# EasyEDA Pro project ProPrj_智能警报器（终版）_2025-03-04_22-10-02_2025-04-22.epro, board 检测装置PCB
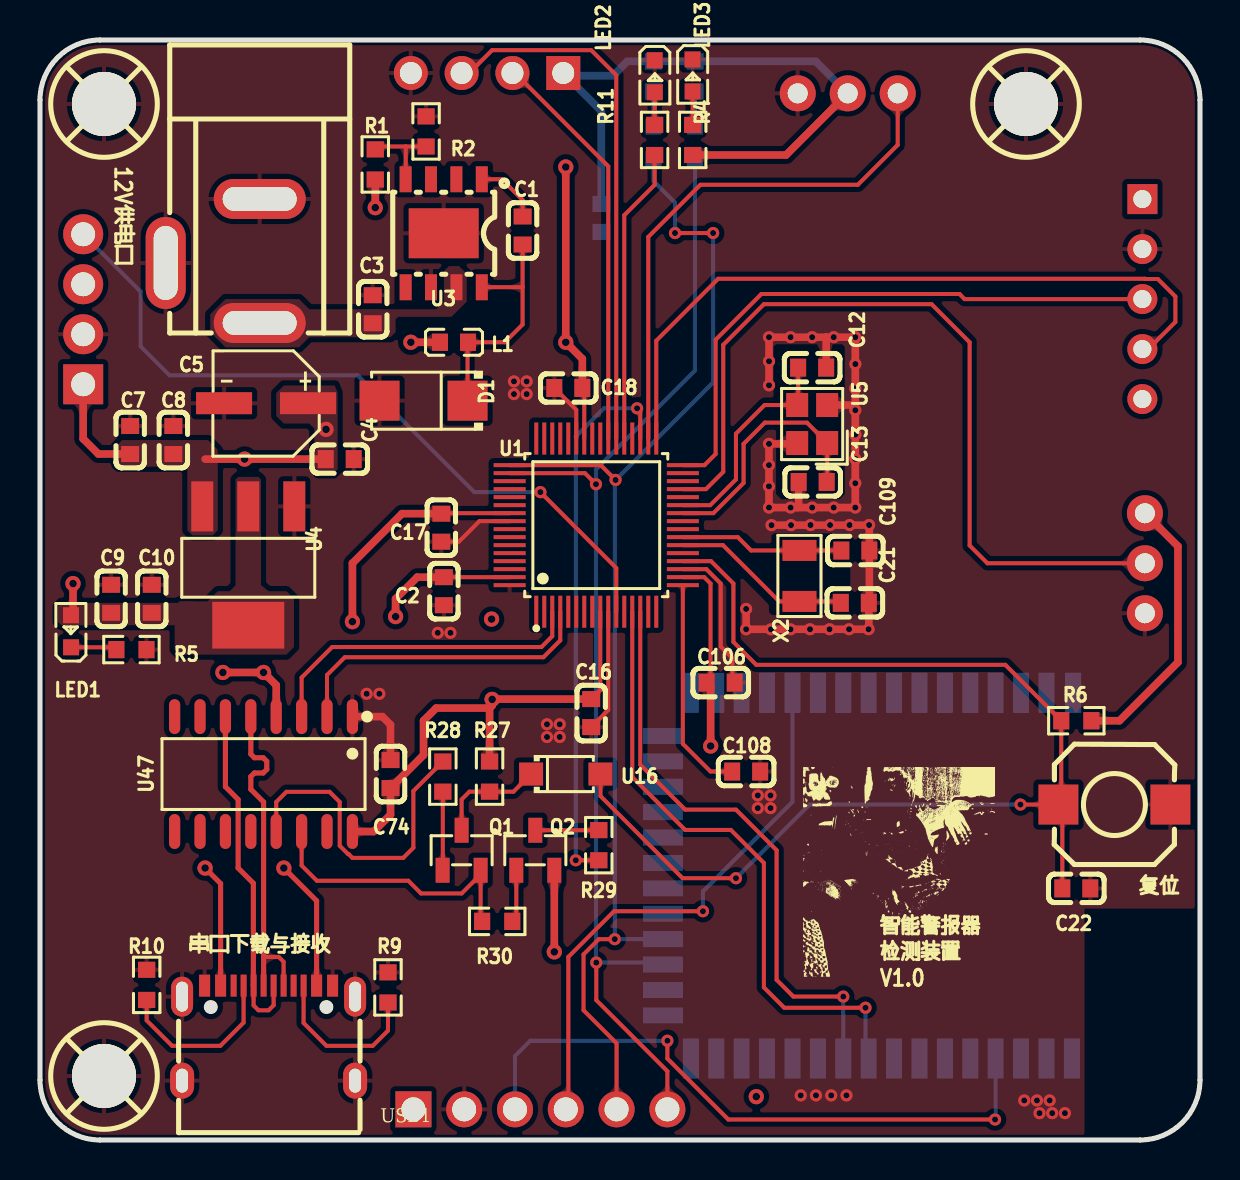
[diagram p14: board, top side]
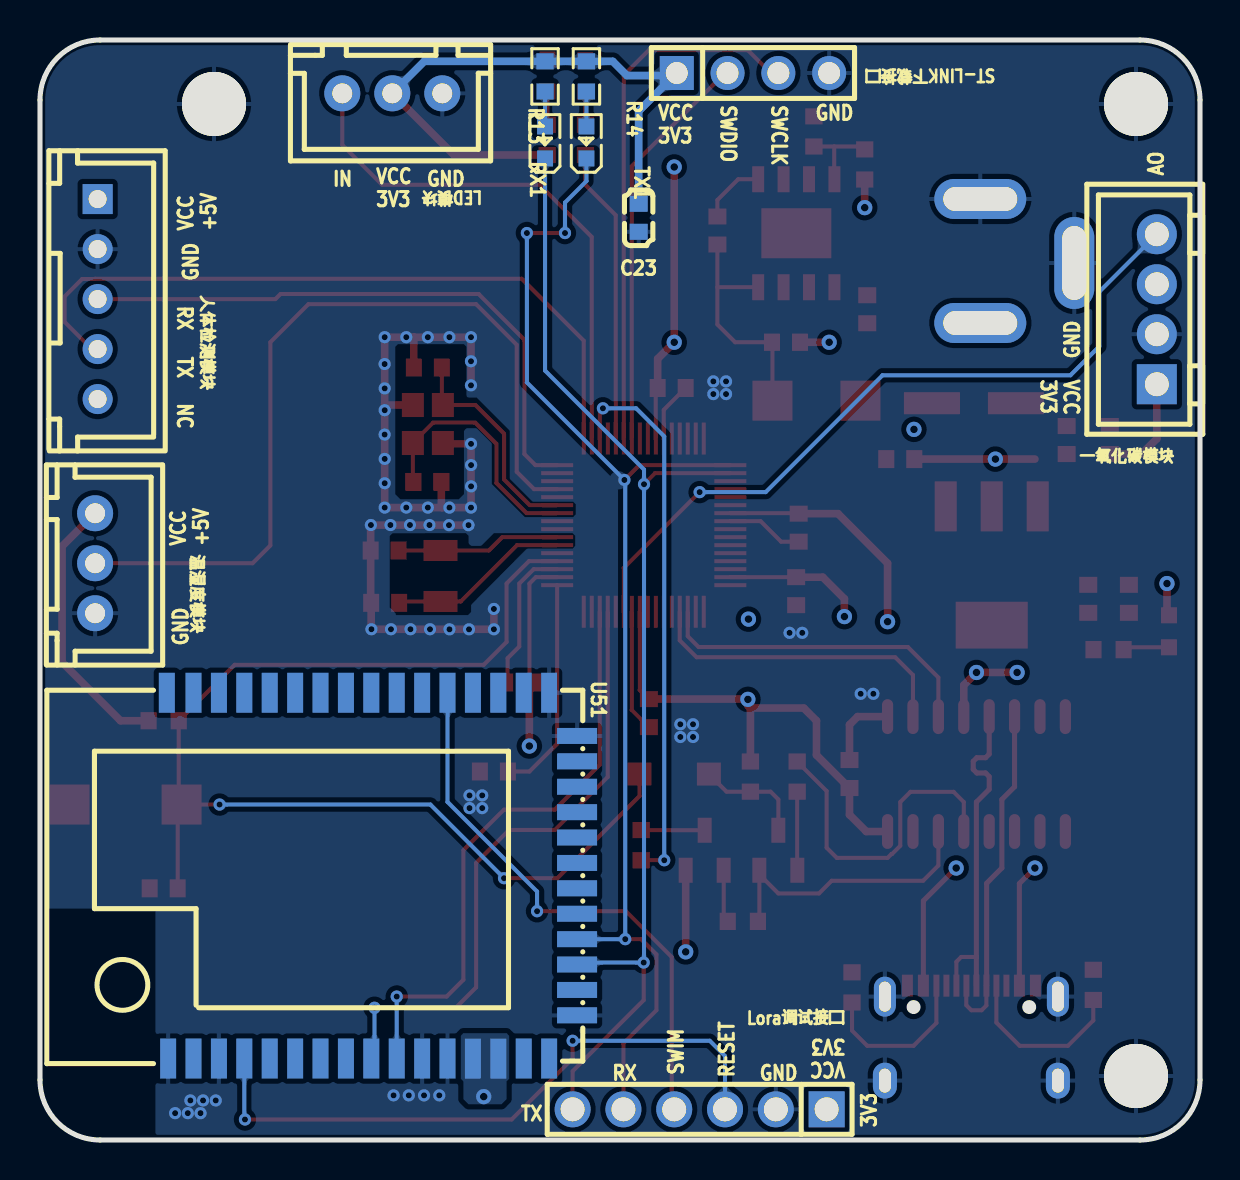
[diagram p15: board, bottom side, seen from below]

Outline 58 x 55 mm; copper layers: Top Layer, 电源层, 接地层, Bottom Layer. Coordinates in mm from the lower left corner of the outline.
Outline path: 0,52 0,3 arc(0.88,0.88) 3,0 55,0 arc(57.12,0.88) 58,3 58,52 arc(57.12,54.12) 55,55 3,55 arc(0.88,54.12) 0,52
Stack: Top Layer 0.035mm 外层铜厚1oz / Dielectric1 0.2104mm 7628 RC49% 8.6mil / 电源层 0.0152mm 内层铜厚 / Dielectric2 1.065mm 1.1mm H/HOZ Copper / 接地层 0.0152mm 内层铜厚 / Dielectric3 0.2104mm 7628 RC49% 8.6mil / Bottom Layer 0.035mm 外层铜厚1oz

## Design rules (mm)
net USB_D+: DP1
net USB_D-: DP1
template: 自定义配置
spacing copperThickness1oz (default): track to track 0.102, other pairs 0.152 to 0.3
spacing copperThickness2oz: track to track 0.203, other pairs 0.152 to 0.3
track width copperThickness1oz (default): min 0.127, default 0.203, max 2.54
track width copperThickness2oz: min 0.203, default 0.254, max 2.54
track width GND: min 0.254, default 0.381, max 2.54
track width VCC: min 0.254, default 0.381, max 2.54
differential pair differentialPair (default): width min 0.127, default 0.254, max 2.54; gap min 0.152, default 0.152
via viaSize (default): diameter min 0.5, default 0.61, max 10; hole min 0.3, default 0.305, max 6.299
via viaSize1: diameter min 0.61, default 0.762, max 10; hole min 0.305, default 0.381, max 6.3

## Placement (name value [footprint] x y rotation side)
C1  10NF  [C0603]  24.13 45.47 270 top
C2  100nF  [C0603]  20.19 27.44 90 top
C3  10uF  [C0603]  16.64 41.54 270 top
C4  10nF  [C0603]  14.99 34.05 180 top
C5  330uF  [CAP-SMD_BD5.0-L5.3-W5.3-FD]  11.3 36.84 180 top
C7  10uF  [C0603]  4.51 35 270 top
C8  100nF  [C0603]  6.67 35 270 top
C9  10uF  [C0603]  3.56 27.06 90 top
C10  100nF  [C0603]  5.59 27.06 90 top
C12  12pF  [C0603]  38.61 38.62 0 top
C13  12pF  [C0603]  38.63 32.9 180 top
C16  100nF  [C0603]  27.56 21.34 90 top
C17  100nF  [C0603]  20.07 30.62 90 top
C18  100nF  [C0603]  26.42 37.6 0 top
C21  10pF  [C0603]  40.74 26.86 180 top
C22  10nF  [C0603]  51.82 12.58 180 top
C23  100nF  [C0603]  28.07 46.11 90 bottom
C74  10uF  [C0603]  17.53 18.3 270 top
C106  100nF  [C0603]  34.04 22.87 180 top
C108  2.2uF  [C0603]  35.31 18.42 180 top
C109  10pF  [C0603]  40.77 29.47 180 top
CN1  WAFER-XH254Z-4A  [CONN-TH_XH-4A]  2.16 41.54 90 bottom
D1  B340A  [SMA_L4.3-W2.6-LS5.1-RD]  19.18 36.97 180 top
DC2  -  [DC-005_2.5]  10.67 44.08 90 top
H5  -  [HDR-TH_6P-P2.54-V-M-1]  25.02 1.53 0 bottom
H6  -  [HDR-TH_4P-P2.54-V-M]  22.35 53.35 180 bottom
L1  15uH  [L0603]  20.7 39.89 0 top
LED1  -  [LED_0603]  1.54 25.49 90 top
LED2  -  [LED_0603]  30.74 53.14 270 top
LED3  -  [LED_0603]  32.64 53.18 270 top
Q1  S8050  [SOT-23-3_L2.9-W1.3-P1.90-LS2.4-BR]  21.08 14.49 270 top
Q2  S8550  [SOT-23-3_L2.9-W1.3-P1.90-LS2.4-BR]  24.76 14.49 270 top
R1  10KΩ  [R0603]  16.76 48.78 90 top
R2  3.24KΩ  [R0603]  19.3 50.43 90 top
R4  1KΩ  [R0603]  32.64 50 270 top
R5  2kΩ  [R0603]  4.57 24.52 0 top
R6  1KΩ  [R0603]  51.82 20.96 0 top
R9  5.1KΩ  [R0603]  17.4 7.63 90 top
R10  5.1KΩ  [R0603]  5.33 7.76 90 top
R11  1KΩ  [R0603]  30.73 50 270 top
R13  1kΩ  [R0603]  32.75 53.18 90 bottom
R14  1kΩ  [R0603]  30.68 53.18 90 bottom
R27  10K  [R0603]  22.48 18.17 90 top
R28  1K  [R0603]  20.14 18.17 270 top
R29  1K  [R0603]  27.94 14.74 90 top
R30  1K  [R0603]  22.86 10.93 0 top
RX1  KT-0603R  [LED0603-RD]  32.75 49.88 90 bottom
SCREW1  -  [M3螺丝]  3.2 51.8 0 top
SCREW2  -  [M3螺丝]  49.3 51.8 0 top
SCREW3  -  [M3螺丝]  3.2 3.2 0 top
TX1  KT-0603R  [LED0603-RD]  30.68 49.88 90 bottom
U1  HT32F52352  [LQFP-64_L7.0-W7.0-P0.40-LS9.2-BL]  27.81 30.74 0 top
U3  TPS5430DDAR  [ESOP-8_L4.9-W3.9-P1.27-LS6.0-TL-EP]  20.19 45.34 270 top
U4  AMS1117-3.3  [SOT-223-3_L6.5-W3.4-P2.30-LS7.0-BR]  10.41 28.71 90 top
U5  8MHz  [CRYSTAL-SMD_4P-L2.5-W2.0-BL]  38.61 35.8 90 top
U9  轻触开关/软触开关(无声)/贴片6*6*5  [SW-SMD_L6.0-W5.9-LS6.6]  53.72 16.77 180 top
U16  1N4007W  [SOD-123FL_L2.7-W1.8-LS3.7-RD]  26.29 18.3 0 top
U47  CH340C  [SOP-16_L10.0-W3.9-P1.27-LS6.0-BL]  11.18 18.3 180 top
U48  WAFER-XH254Z-5A  [CONN-TH_5P-P2.50_WAFER-XH254Z-5A]  55.12 42.05 270 bottom
U49  WAFER-XH254Z-3A  [CONN-TH_XH-3A]  55.25 28.84 270 bottom
U50  WAFER-XH254Z-3A  [CONN-TH_XH-3A]  40.39 52.33 0 bottom
U51  WH-L101-L-C  [COMM-SMD_WH-L101-L-C]  41.4 13.22 90 bottom
USB1  TYPE-C 16PIN 2MD(073)  [USB-C-SMD_TYPE-C-6PIN-2MD-073]  11.43 5.34 0 top
X2  32.768kHz  [OSC-SMD_L3.2-W1.5]  37.97 28.2 90 top

## Footprints (pads in the part's own frame, mm; a bottom-side part is the same pattern mirrored in y, then rotated)
C0603
  rect 0.8x0.9 smd: 1(-0.7,0) 2(0.7,0)
CAP-SMD_BD5.0-L5.3-W5.3-FD
  rect 2.8x1.1 smd: 1(-2.1,0) 2(2.1,0)
COMM-SMD_WH-L101-L-C
  rect 2x0.8 smd: 1(-9.144,10.192) 2(-9.144,8.922) 3(-9.144,7.652) 4(-9.144,6.382) 5(-9.144,5.112) 6(-9.144,3.842) 7(-9.144,2.572) 8(-9.144,1.302) 9(-9.144,0.032) 10(-9.144,-1.238) 11(-9.144,-2.509) 12(-9.144,-3.779) 13(-9.144,-5.048) 14(-9.144,-6.319) 15(-9.144,-7.588) 16(-9.144,-8.858) 29(9.144,-8.858) 30(9.144,-7.588) 31(9.144,-6.319) 32(9.144,-5.048) 33(9.144,-3.779) 34(9.144,-2.509) 35(9.144,-1.238) 36(9.144,0.032) 37(9.144,1.302) 38(9.144,2.572) 39(9.144,3.842) 40(9.144,5.112) 41(9.144,6.382) 42(9.144,7.652) 43(9.144,8.922) 44(9.144,10.255)
  rect 0.8x2 smd: 17(-6.985,-10.255) 18(-5.715,-10.255) 19(-4.445,-10.255) 20(-3.175,-10.255) 21(-1.905,-10.255) 22(-0.635,-10.255) 23(0.635,-10.255) 24(1.905,-10.255) 25(3.175,-10.255) 26(4.445,-10.255) 27(5.715,-10.255) 28(6.985,-10.255)
CONN-TH_5P-P2.50_WAFER-XH254Z-5A
  rect 1.5x1.5 hole 0.9: 1(-5,0)
  round 1.5 hole 0.9: 2(-2.5,0) 3(0,0) 4(2.5,0) 5(5,0)
CONN-TH_XH-3A
  round 1.8 hole 1: 1(-2.5,0) 2(0,0) 3(2.5,0)
CONN-TH_XH-4A
  rect 2x2 hole 1.2: 1(-3.75,0)
  round 2 hole 1.2: 2(-1.25,0) 3(1.25,0) 4(3.75,0)
CRYSTAL-SMD_4P-L2.5-W2.0-BL
  rect 1.2x1.1 smd: 1(-0.95,-0.75) 2(0.95,-0.75) 3(0.95,0.75) 4(-0.95,0.75)
DC-005_2.5
  oval 2x4.6 hole 1.2x3.7: 1(-3.227,-0.318) 2(2.973,-0.318)
  oval 4.6x2 hole 3.7x1.2: 3(-0.227,4.382)
ESOP-8_L4.9-W3.9-P1.27-LS6.0-TL-EP
  rect 1.3x0.6 smd: 1(-2.7,1.905) 2(-2.7,0.635) 3(-2.7,-0.635) 4(-2.7,-1.905) 5(2.7,-1.905) 6(2.7,-0.635) 7(2.7,0.635) 8(2.7,1.905)
  rect 2.5x3.5 smd: 9(0,0)
HDR-TH_4P-P2.54-V-M
  rect 1.7x1.7 hole 1.1: 1(-3.81,0)
  round 1.7 hole 1.1: 2(-1.27,0) 3(1.27,0) 4(3.81,0)
HDR-TH_6P-P2.54-V-M-1
  rect 1.8x1.8 hole 1.2: 1(-6.35,0)
  round 1.8 hole 1.2: 2(-3.81,0) 3(-1.27,0) 4(1.27,0) 5(3.81,0) 6(6.35,0)
L0603
  rect 0.8x0.864 smd: 1(-0.7,0) 2(0.7,0)
LED0603-RD
  rect 0.8x0.8 smd: 1(-0.799,0) 2(0.799,0)
LED_0603
  rect 0.8x0.8 smd: 1(-0.851,-0.01) 2(0.75,-0.005)
LQFP-64_L7.0-W7.0-P0.40-LS9.2-BL
  rect 0.2x1.6 smd: 1(-3,-4.33) 2(-2.6,-4.33) 3(-2.2,-4.33) 4(-1.8,-4.33) 5(-1.4,-4.33) 6(-1,-4.33) 7(-0.6,-4.33) 8(-0.2,-4.33) 9(0.2,-4.33) 10(0.6,-4.33) 11(1,-4.33) 12(1.4,-4.33) 13(1.8,-4.33) 14(2.2,-4.33) 15(2.6,-4.33) 16(3,-4.33) 33(3,4.33) 34(2.6,4.33) 35(2.2,4.33) 36(1.8,4.33) 37(1.4,4.33) 38(1,4.33) 39(0.6,4.33) 40(0.2,4.33) 41(-0.2,4.33) 42(-0.6,4.33) 43(-1,4.33) 44(-1.4,4.33) 45(-1.8,4.33) 46(-2.2,4.33) 47(-2.6,4.33) 48(-3,4.33)
  rect 1.6x0.2 smd: 17(4.33,-3) 18(4.33,-2.6) 19(4.33,-2.2) 20(4.33,-1.8) 21(4.33,-1.4) 22(4.33,-1) 23(4.33,-0.6) 24(4.33,-0.2) 25(4.33,0.2) 26(4.33,0.6) 27(4.33,1) 28(4.33,1.4) 29(4.33,1.8) 30(4.33,2.2) 31(4.33,2.6) 32(4.33,3) 49(-4.33,3) 50(-4.33,2.6) 51(-4.33,2.2) 52(-4.33,1.8) 53(-4.33,1.4) 54(-4.33,1) 55(-4.33,0.6) 56(-4.33,0.2) 57(-4.33,-0.2) 58(-4.33,-0.6) 59(-4.33,-1) 60(-4.33,-1.4) 61(-4.33,-1.8) 62(-4.33,-2.2) 63(-4.33,-2.6) 64(-4.33,-3)
M3螺丝
  round 3.2 hole 3.2: 1(0,0)
OSC-SMD_L3.2-W1.5
  rect 1.05x1.7 smd: 1(-1.275,0) 2(1.275,0)
R0603
  rect 0.806x0.864 smd: 1(-0.753,0) 2(0.753,0)
SMA_L4.3-W2.6-LS5.1-RD
  rect 2x2 smd: 1(-2.2,0) 2(2.2,0)
SOD-123FL_L2.7-W1.8-LS3.7-RD
  rect 1.2x1.15 smd: 1(-1.735,0) 2(1.735,0)
SOP-16_L10.0-W3.9-P1.27-LS6.0-BL
  oval 0.56x1.745 smd: 1(-4.445,-2.873) 2(-3.175,-2.873) 3(-1.905,-2.873) 4(-0.635,-2.873) 5(0.635,-2.873) 6(1.905,-2.873) 7(3.175,-2.873) 8(4.445,-2.873) 9(4.445,2.873) 10(3.175,2.873) 11(1.905,2.873) 12(0.635,2.873) 13(-0.635,2.873) 14(-1.905,2.873) 15(-3.175,2.873) 16(-4.445,2.873)
SOT-23-3_L2.9-W1.3-P1.90-LS2.4-BR
  rect 1.25x0.7 smd: 1(1,-0.95) 2(1,0.95) 3(-1,0)
SOT-223-3_L6.5-W3.4-P2.30-LS7.0-BR
  rect 2.5x1.1 smd: 1(2.97,-2.3) 2(2.97,0) 3(2.97,2.3)
  rect 2.34x3.6 smd: 4(-2.97,0)
SW-SMD_L6.0-W5.9-LS6.6
  rect 2x2 smd: 1(-2.8,0) 2(2.8,0)
USB-C-SMD_TYPE-C-6PIN-2MD-073
  rect 0.55x1.1 smd: 1(-3.2,2.375) 2(-2.4,2.375) 11(2.4,2.375) 12(3.2,2.375)
  rect 0.3x1.1 smd: 3(-1.75,2.375) 4(-1.25,2.375) 5(-0.75,2.375) 6(-0.25,2.375) 7(0.25,2.375) 8(0.75,2.375) 9(1.25,2.375) 10(1.75,2.375)
  oval 1.1x2 hole 0.6x1.5: 13(-4.325,1.825) 14(4.325,1.825)
  oval 1.2x1.8 hole 0.6x1.2: 13(-4.325,-2.375) 14(4.325,-2.375)

## Nets
As in the schematic.

Pads without a net: U1 1 2 5 6 7 8 12 15 16 21 24 25 28 30 31 36 40 41 44 45 46 47 48 51 52 53 54 57 58 59 60 61 62; U3 2 3 5; U47 7 8 9 10 11 12 15; U51 2 5 6 7 8 15 16 18 21 22 23 24 25 26 27 30 31 32 34 35 36 37 38 39 40 41 42 43 44; USB1 3 9

## Via types
v1: diameter 0.61, hole 0.305, Top Layer to Bottom Layer, 77 vias
v2: diameter 0.762, hole 0.381, Top Layer to Bottom Layer, 18 vias

## Routing (per net, layer and track width the routed paths; a pad name or vN(x,y) marks a point on that pad's centre or on a via; arc(x,y) is an arc through that point)
GND: length 70
  Top Layer w0.203: C106.1 34.62,22.98 34.62,24.09 34.04,24.67 34.04,27.82 33.31,28.54 32.14,28.54 ; C16.1 28.41,21.5 U1.10 ; C17.1 20.94,29.92 21.97,30.94 23.48,30.94 ; C18.1 26.81,36.5 U1.43
  Top Layer w0.381: 39.31,40.14 39.31,40.14 C12.2 ; 39.31,40.14 v1(38.61,40.14) v1(37.53,40.14) v1(36.45,40.14) v1(36.45,38.94) v1(36.45,37.73) ; 39.31,40.14 v1(39.69,40.14) v1(40.76,40.14) v1(40.76,37.58) 40.76,36.82 ; 37.9,31.62 v1(37.53,31.62) v1(36.45,31.62) 36.45,31.62 v1(36.45,32.68) 36.45,33.62 36.32,33.75 ; 37.9,31.62 v1(38.61,31.62) v1(39.69,31.62) v1(40.76,31.62) v1(40.76,32.84) v1(40.76,34.06) v1(40.76,36.49) 40.76,36.82 ; 37.9,31.62 37.93,31.66 C13.2 ; U47.1 17.12,21.17 17.53,20.76 C74.1 ; v1(35.31,26.55) v1(35.31,25.54) 36.55,25.54 v1(36.55,25.53) 36.56,25.54 v1(38.5,25.54) v1(39.48,25.54) v1(40.45,25.54) v1(41.43,25.54) 41.44,25.55 C21.1 41.47,26.88 41.47,30.74 v1(41.45,30.75) 41.45,30.74 v1(37.55,30.74) v1(36.58,30.74) ; 40.76,36.82 40.7,36.75 U5.2 ; v1(36.45,33.75) 36.45,34.81 v1(36.45,34.81) 37.82,34.81 U5.4
  vias: v1(16.33,22.31) v1(16.97,22.31) v1(19.89,25.36) v1(20.52,25.36) v1(23.7,37.93) v1(23.7,37.3) v1(24.33,37.93) v1(24.33,37.3) v1(25.35,20.79) v1(25.35,20.15) v1(25.98,20.79) v1(25.98,20.15) v1(35.89,17.23) v1(35.89,16.59) v1(36.53,17.23) v1(36.53,16.59) v1(37.53,25.53) v1(38.04,2.23) v1(38.53,30.75) v1(38.8,2.23) v1(39.5,30.75) v1(39.56,2.23) v1(40.32,2.23) v1(40.48,30.75) v1(40.77,38.8) v1(40.77,35.27) v1(49.21,1.98) v1(49.85,1.98) v1(49.97,1.34) v1(50.48,1.98) v1(50.61,1.34) v1(51.24,1.34)
VCC+3.3V: length 269.5
  Top Layer w0.203: U1.18 33.21,28.14 33.53,27.82 33.53,23.06 C106.2 ; C18.2 27.21,37.5 U1.42 ; 20.09,31.34 23.48,31.34 ; C16.2 28.01,22.5 U1.9 ; C2.2 20.19,28.14 23.48,28.14
  Top Layer w0.381: 11.81,21.17 11.81,22.74 v2(11.18,23.38) v2(9.14,23.38) ; C18.2 27.12,39.06 v2(26.29,39.89) v2(26.29,48.65) ; C16.2 22.62,22.05 v2(22.61,22.03) 22.61,21.72 22.48,21.6 ; v2(33.53,19.7) 33.53,22.67 C106.2 ; LED1.2 1.65,26.34 v2(1.65,27.82) ; v2(17.78,26.17) 17.78,27.06 18.86,28.14 C2.2 ; R6.2 53.97,20.96 56.9,23.89 56.9,29.69 U49.1 ; U47.16 16.69,15.42 17.53,16.27 C74.2 19.18,19.25 19.18,20.96 19.81,21.6 22.48,21.6 ; v2(15.62,25.92) 15.62,28.84 18.1,31.32 C17.2 ; U50.2 37.3,49.25 R4.2 ; 22.48,21.6 R27.2 ; 25.72,13.49 v2(25.72,9.41)
  电源层 w0.381: v2(22.58,26.04) 24.76,23.86 24.76,22.03 ; 17.73,23.38 21.26,23.38 v2(22.61,22.03) ; 17.73,23.38 17.78,23.43 v2(17.78,26.17) ; 17.73,23.38 15.56,23.38 ; v2(26.29,39.89) 26.29,22.09 26.35,22.03 ; v2(25.72,9.41) 25.72,6.55 28.96,3.31 34.67,3.31 v2(35.81,2.17) ; v2(25.72,9.41) 20.96,9.41 18.67,7.12 H5.1 ; v2(25.72,9.41) 25.78,9.47 25.78,14.87 22.61,18.04 v2(22.61,22.03) ; U50.2 36.7,48.65 v2(26.29,48.65) ; 33.6,22.03 38.84,22.03 48.14,31.34 U49.1 ; 33.6,22.03 26.35,22.03 ; 33.6,22.03 33.53,21.96 v2(33.53,19.7) ; 24.76,22.03 26.35,22.03 ; 24.76,22.03 v2(22.61,22.03) ; v2(9.14,23.38) 3.56,23.38 1.65,25.28 v2(1.65,27.82) ; 15.56,23.38 15.62,23.44 v2(15.62,25.92) ; 15.56,23.38 v2(11.18,23.38)
  Bottom Layer w0.381: 26.29,53.22 28.07,51.44 C23.2 ; 26.29,53.22 H6.1 ; 26.29,53.22 28.65,53.22 29.36,53.93 R14.2 R13.2 38.79,53.93 U50.2
VCC+5V: length 113.5
  Top Layer w0.254: v2(8.25,13.6) 9.03,12.82 USB1.2 ; USB1.11 13.83,11.96 v2(12.19,13.6)
  Top Layer w0.381: CN1.1 2.16,35.06 2.92,34.3 4.51,34.3 ; v2(18.54,39.89) L1.1 ; C4.2 v2(10.23,34.05) 8.25,34.05 ; R1.1 v2(16.76,46.62)
  电源层 w0.381: v2(18.54,39.89) 18.41,39.89 17.15,38.62 15.37,38.62 14.34,37.59 14.34,35.69 14.3,35.66 v2(14.3,35.53) ; v2(10.23,34.05) 10.23,36.66 12.32,38.74 14.1,38.74 15.49,40.14 15.49,45.35 v2(16.76,46.62) 54.69,46.62 U48.1 ; v2(8.25,13.6) 10.24,13.6 ; 10.24,13.6 v2(12.19,13.6) ; 10.24,13.6 10.24,34.05
AO: length 37.4
  Top Layer w0.203: v1(25.02,32.39) 28.81,28.6 U1.11
  Bottom Layer w0.203: v1(25.02,32.39) 21.72,32.39 15.88,38.24 6.48,38.24 5.03,39.68 5.03,42.42 CN1.4
BOOT: length 27.5
  Top Layer w0.203: U1.35 30.01,36.58 ; R29.1 v1(26.79,13.99)
  Bottom Layer w0.203: v1(29.85,36.58) 28.19,36.58 26.79,35.18 v1(26.79,13.99)
CH_RXD: length 16.6
  Top Layer w0.203: U47.3 13.08,23.12 14.6,24.65 25.07,24.65 25.61,25.19 U1.3
CH_TXD: length 15.9
  Top Layer w0.203: U1.4 26.01,24.98 25.17,24.14 15.24,24.14 14.35,23.25 U47.2
DTR: length 16.3
  Top Layer w0.203: R28.1 18.67,17.45 18.67,14.61 18.16,14.11 15.62,14.11 15.43,14.3 15.4,14.3 14.99,14.71 14.99,16.9 14.48,17.41 12.32,17.41 11.81,16.9 11.81,15.42
IN: length 27
  Top Layer w0.203: U1.34 30.41,45.15 33.02,47.76 40.89,47.76 42.89,49.75 U50.3
LORA_IO1: length 31
  Top Layer w0.203: U1.13 29.61,18.15 32.26,15.5 34.54,15.5 36.19,13.85 36.19,7.63 37.21,6.61 v1(41.28,6.61)
  Bottom Layer w0.203: v1(41.28,6.61) 41.28,4.23 U51.9
LORA_IO2: length 29.5
  Top Layer w0.203: v1(40.16,7.17) 37.67,7.17 36.83,8.01 36.83,14.49 34.8,16.52 32.26,16.52 30.01,18.76 U1.14
  Bottom Layer w0.203: U51.10 v1(40.16,7.17)
LORA_RESET: length 32.2
  Top Layer w0.203: v1(31.37,4.96) 31.37,4.07 34.42,1.03 v1(47.75,1.03)
  Bottom Layer w0.203: H5.3 23.75,4.2 24.51,4.96 v1(31.37,4.96) ; v1(47.75,1.03) 47.78,1.06 U51.4
LORA_RX: length 61.7
  Top Layer w0.203: v1(28.78,33) 28.04,33.74 23.48,33.74 ; H5.5 28.83,4.84 27.18,6.49 27.18,9.28 27.94,10.04 v1(28.74,10.04) ; v1(33.66,45.35) v1(31.75,45.35)
  Bottom Layer w0.203: v1(31.75,45.35) 31.75,46.87 30.68,47.94 TX1.1 ; 31.15,10.04 v1(28.74,10.04) 28.74,32.96 v1(28.78,33) 33.66,37.88 v1(33.66,45.35)
LORA_SWIM: length 28.1
  Top Layer w0.203: v1(33.15,11.44) 28.7,11.44 26.42,9.15 26.42,1.66 26.29,1.53
  Bottom Layer w0.203: U51.33 37.62,16.9 33.15,12.43 v1(33.15,11.44)
LORA_TX: length 59
  Top Layer w0.203: H5.6 31.37,3.44 27.81,6.99 v1(27.81,8.87) ; 23.48,33.34 27.25,33.34 v1(27.8,32.79)
  Bottom Layer w0.203: 31.15,8.77 31.05,8.87 v1(27.81,8.87) 27.8,8.89 v1(27.8,32.79) 27.8,33.52 32.75,38.47 RX1.1
NRST: length 59.7
  Top Layer w0.203: C22.2 51.12,16.58 U9.2 ; U9.2 51.06,16.92 R6.1 48.27,23.76 35.81,23.76 34.67,24.9 34.67,27.82 33.55,28.94 U1.20 ; U9.2 v1(49.02,16.77) ; U16.2 28.02,17.2 32.13,13.09 v1(34.8,13.09)
  Bottom Layer w0.203: v1(49.02,16.77) 38.48,16.77 v1(34.8,13.09)
OUT1: length 42
  Top Layer w0.203: U49.2 47.37,28.84 46.48,29.73 46.48,39.89 44.58,41.79 36.19,41.79 34.16,39.76 34.16,33.41 33.3,32.54 32.14,32.54
PA11: length 14.8
  Top Layer w0.203: U1.37 29.21,46.24 30.73,47.76 30.73,49.25 R11.2
PA12: length 26.8
  Top Layer w0.203: 21.21,53.22 21.34,53.22 22.61,54.49 27.56,54.49 28.81,53.24 U1.38
PA13: length 20.2
  Top Layer w0.203: 23.75,53.22 23.88,53.22 28.41,48.69 U1.39
PC12: length 30
  Top Layer w0.203: U1.32 33.23,33.74 33.78,34.3 33.78,40.01 36.07,42.3 45.97,42.3 46.23,42.05 U48.3
PC13: length 36
  Top Layer w0.203: U48.4 55.41,39.55 56.77,40.9 56.77,42.17 55.89,43.05 55.26,43.05 55.25,43.06 33.91,43.06 30.81,39.97 U1.33
RTS: length 14.2
  Top Layer w0.203: 22.03,13.28 22.03,11.01 R30.1 ; 22.03,13.28 21.08,12.33 19.05,12.33 18.41,12.96 13.84,12.96 13.08,13.72 U47.14 ; 22.03,13.28 Q1.2
USB_D+: length 17.2
  Top Layer w0.203: 11.18,9.15 11.94,9.15 12.18,8.91 USB1.8
  Top Layer w0.254: USB1.6 11.18,16.9 10.54,17.53 10.54,18.17 10.72,18.35 11.16,18.35 11.34,18.53 11.34,18.93 11.16,19.11 10.72,19.11 10.54,19.29 U47.5
USB_D-: length 17.2
  Top Layer w0.203: USB1.7 11.68,7.71 11.68,6.74 11.43,6.49 10.92,6.49 10.68,6.73 USB1.5
  Top Layer w0.254: USB1.5 10.67,7.73 10.67,12.84 9.91,13.6 9.91,17.03 9.27,17.66 U47.6
X32KIN: length 9.1
  Top Layer w0.203: U1.22 34.15,29.74 36.96,26.93 X2.1 39.97,26.93 C21.2
X32KOUT: length 8.2
  Top Layer w0.203: U1.23 34.89,30.14 35.56,29.48 X2.2 40.06,29.48 C109.2
XATLOUT: length 11
  Top Layer w0.203: U1.27 33.51,31.74 34.8,33.03 34.8,35.31 36.23,36.75 U5.3 37.91,36.8 C12.1
XTALIN: length 12.6
  Top Layer w0.203: C13.1 39.36,32.93 U5.1 39.36,34.86 38.35,35.87 36.24,35.87 35.18,34.81 35.18,32.85 33.67,31.34 32.14,31.34
$1N6895: length 2.6
  Top Layer w0.203: R30.2 23.81,11.13 Q2.1
$1N6912: length 3.2
  Top Layer w0.203: R29.2 27.93,15.49 Q2.3
$1N6913: length 3.9
  Top Layer w0.203: Q1.1 20.14,13.5 R28.2
$1N6917: length 5.5
  Top Layer w0.203: U16.1 23.67,17.42 R27.1 21.47,17.42 21.08,17.03 Q1.3
$1N9078: length 1.7
  Bottom Layer w0.203: R14.1 TX1.2
$1N9093: length 1.7
  Bottom Layer w0.203: R13.1 RX1.2
$2N414: length 12.1
  Top Layer w0.203: 24.13,42.64 24.13,40.78 23.24,39.89 L1.2 21.38,39.86 D1.1 ; 24.13,42.64 22.09,42.64 U3.8 ; 24.13,42.64 24.13,44.78
$2N415: length 3.3
  Top Layer w0.203: U3.1 23.09,48.04 24.13,47 C1.1
$2N416: length 3.8
  Top Layer w0.203: 18.28,49.67 R2.1 ; 18.28,49.67 18.29,49.67 18.29,48.05 U3.4 ; 18.28,49.67 17.15,49.67
$2N4500: length 2.3
  Top Layer w0.203: 1.55,24.64 3.7,24.64 R5.1
$3N3726: length 1.7
  Top Layer w0.203: R4.1 32.64,52.42 LED3.2
$3N3729: length 1.6
  Top Layer w0.203: R11.1 30.74,50.77 LED2.2
$3N8921: length 11
  Top Layer w0.203: C108.2 33.53,18.42 32.14,19.81 U1.17
$3N14908: length 8.3
  Top Layer w0.203: USB1.10 13.18,5.85 14.32,4.71 16.64,4.71 17.4,5.47 R9.1
$3N14923: length 8.7
  Top Layer w0.203: USB1.4 10.18,5.87 9.02,4.71 6.6,4.71 5.33,5.98 R10.1

## Copper pours and planes (outline as drawn; the poured copper is in the pictures)
GND on Top Layer: -0.38,55.25 58.29,55.25 58.29,-0.25 -0.38,-0.25
GND on Bottom Layer: -0.38,55.25 58.29,55.25 58.29,-0.25 -0.38,-0.25
GND on 接地层: -0.38,55.25 58.42,55.25 58.42,-0.88 -0.38,-0.88
VCC+3.3V on Top Layer: 6.73,33.16 12.7,33.16 12.7,24.27 6.73,24.27
VCC+3.3V on Top Layer: 0.89,26.93 7.75,26.93 7.75,25.74 0.89,25.74
VCC+3.3V on Bottom Layer: 34.54,5.34 36.96,5.34 36.96,1.79 34.54,1.79
VCC+5V on Top Layer: 11.81,37.73 14.88,37.73 14.88,33.34 11.81,33.34
VCC+5V on Top Layer: 3.81,35 8.89,35 8.89,30.23 3.81,30.23
VCC_IN on Top Layer: 15.75,43.7 21.34,43.7 21.34,40.14 15.75,40.14
VCC_IN on Top Layer: 8.51,42.05 17.35,42.05 17.35,39.63 8.51,39.63

Small or netless copper shapes (teardrops, artwork), in the pictures only: 220 on Top Layer, 42 on Bottom Layer, 29 on 电源层

## Text on the board
Bottom Silkscreen Layer: GND | VCC / 3V3 | IN | SWCLK | SWDIO | AO | 3V3 | RESET | SWIM | VCC / +5V | RX | TX | NC | ST-LINK下载接口 | LED模块 | Lora调试接口 | 人体检测模块 | 温湿度模块 | 一氧化碳模块
Top Silkscreen Layer: 串口下载与接收 | 智能警报器 / 检测装置 / V1.0 | 复位 | 12V供电口
